# EAGLE design Led Controller (EAGLE 9.3.2)
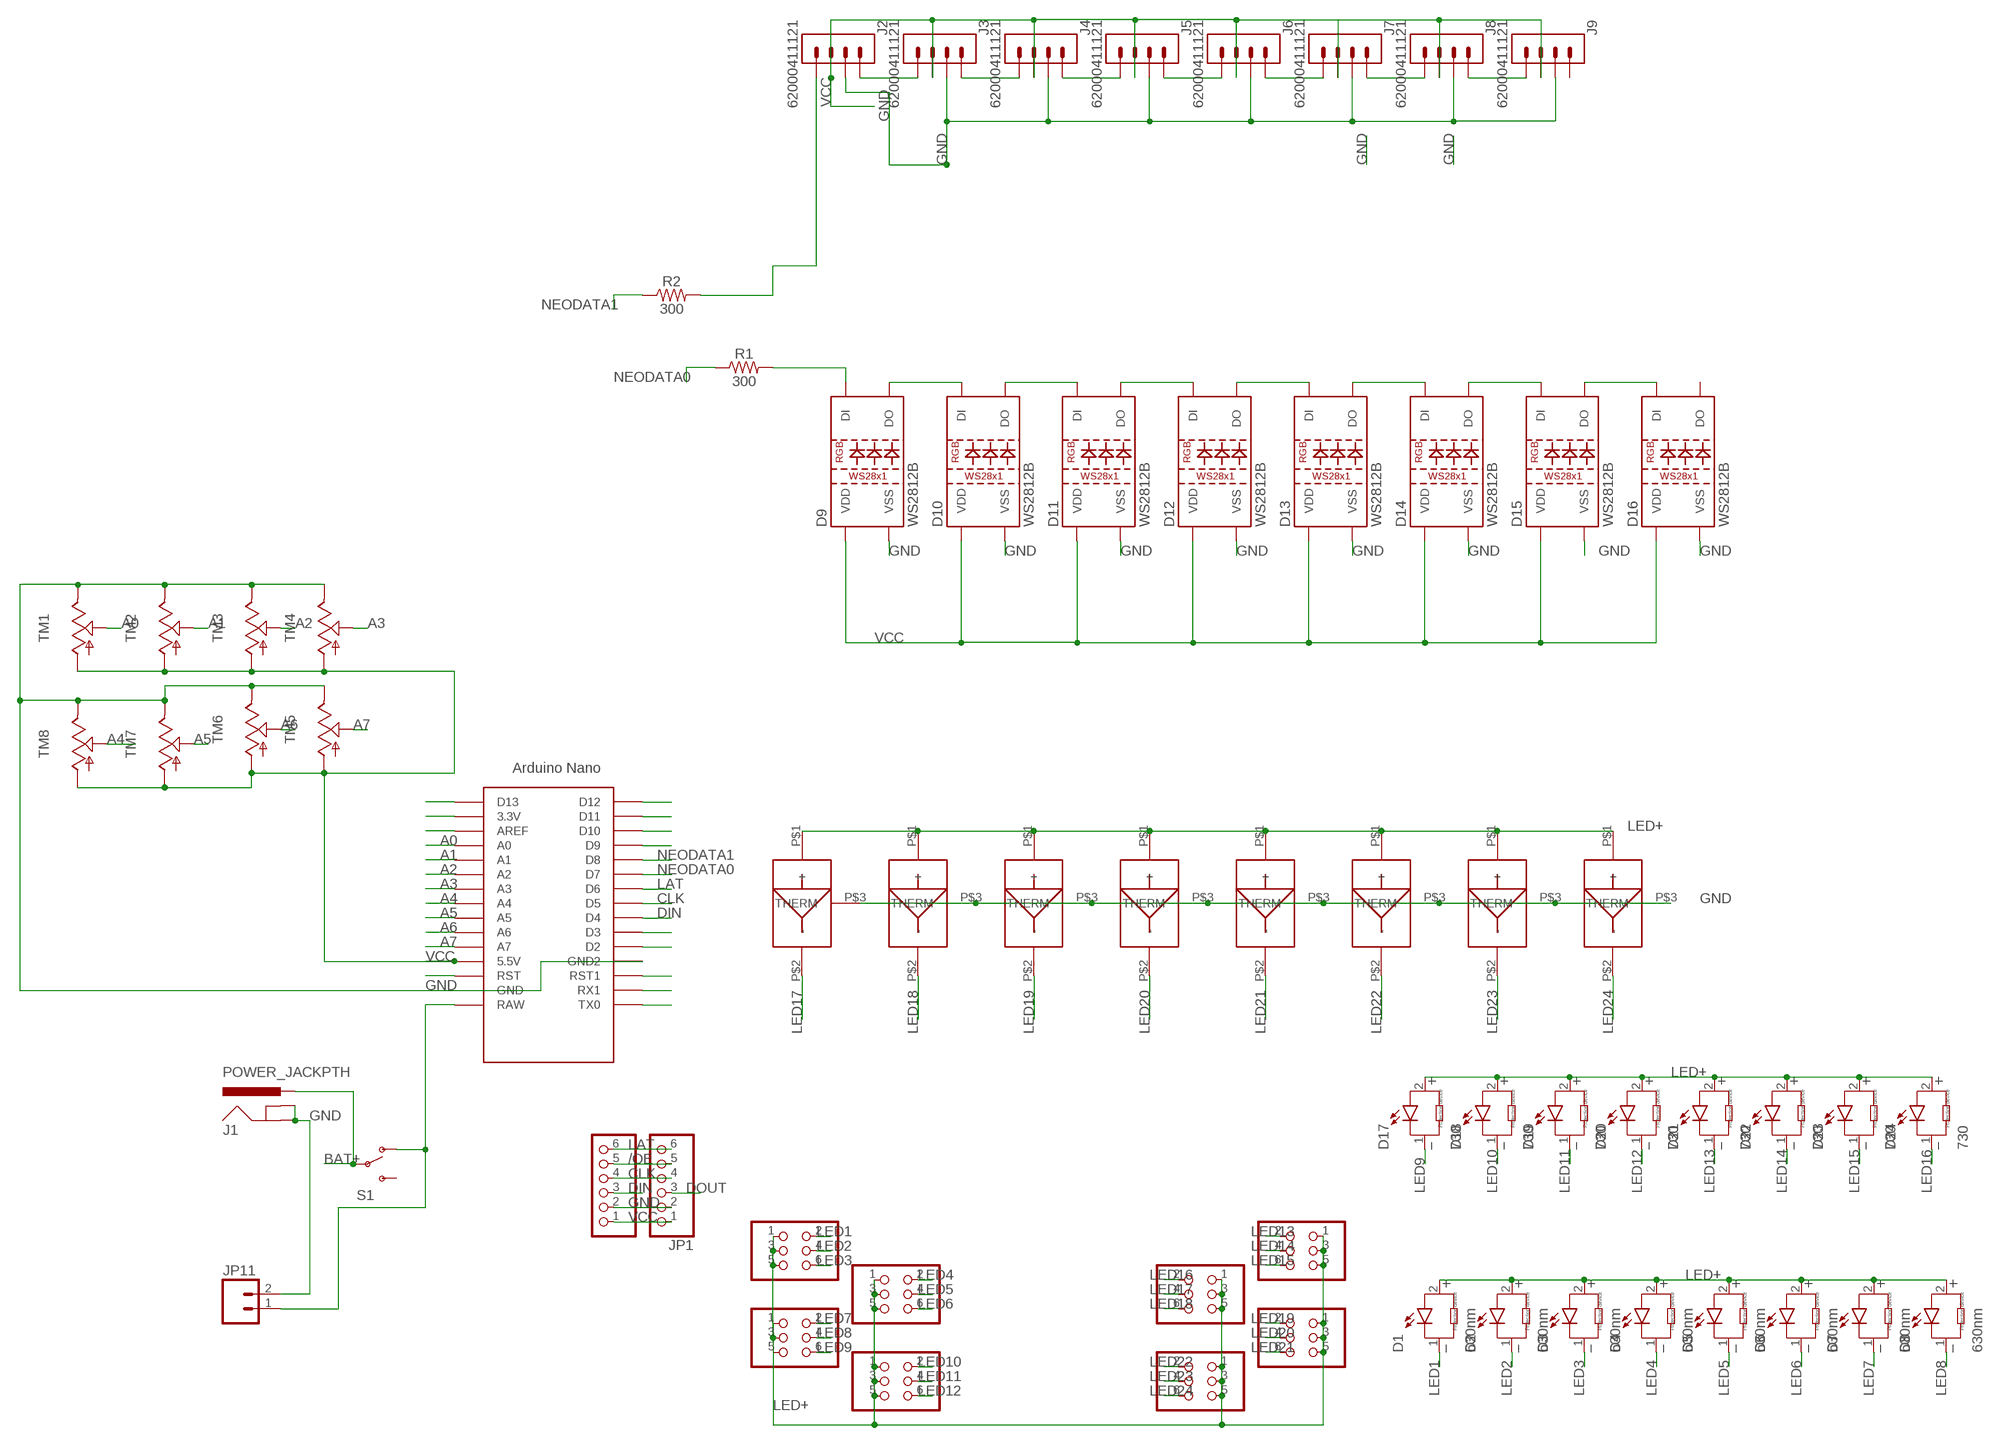
[diagram p0: schematic, sheet 1]

## Parts
D1  630nm  WL-SWTC_3535_158353027_2700K  [WL-SWTC_3535]
D2  630nm  WL-SWTC_3535_158353027_2700K  [WL-SWTC_3535]
D3  630nm  WL-SWTC_3535_158353027_2700K  [WL-SWTC_3535]
D4  630nm  WL-SWTC_3535_158353027_2700K  [WL-SWTC_3535]
D5  630nm  WL-SWTC_3535_158353027_2700K  [WL-SWTC_3535]
D6  630nm  WL-SWTC_3535_158353027_2700K  [WL-SWTC_3535]
D7  630nm  WL-SWTC_3535_158353027_2700K  [WL-SWTC_3535]
D8  630nm  WL-SWTC_3535_158353027_2700K  [WL-SWTC_3535]
D9  WS2812B  [WS2812B]
D10  WS2812B  [WS2812B]
D11  WS2812B  [WS2812B]
D12  WS2812B  [WS2812B]
D13  WS2812B  [WS2812B]
D14  WS2812B  [WS2812B]
D15  WS2812B  [WS2812B]
D16  WS2812B  [WS2812B]
D17  730  WL-SWTC_3535_158353027_2700K  [WL-SWTC_3535]
D18  730  WL-SWTC_3535_158353027_2700K  [WL-SWTC_3535]
D19  730  WL-SWTC_3535_158353027_2700K  [WL-SWTC_3535]
D20  730  WL-SWTC_3535_158353027_2700K  [WL-SWTC_3535]
D21  730  WL-SWTC_3535_158353027_2700K  [WL-SWTC_3535]
D22  730  WL-SWTC_3535_158353027_2700K  [WL-SWTC_3535]
D23  730  WL-SWTC_3535_158353027_2700K  [WL-SWTC_3535]
D24  730  WL-SWTC_3535_158353027_2700K  [WL-SWTC_3535]
J1  POWER_JACKPTH  [POWER_JACK_PTH]
J2  62000411121  [62000411121]
J3  62000411121  [62000411121]
J4  62000411121  [62000411121]
J5  62000411121  [62000411121]
J6  62000411121  [62000411121]
J7  62000411121  [62000411121]
J8  62000411121  [62000411121]
J9  62000411121  [62000411121]
JP1  INPUT  PINHD-1X6CB  [1X06-CLEANBIG]
JP2  HEADER-2X3  [2X03_ROUND_70MIL]
JP3  HEADER-2X3  [2X03_ROUND_70MIL]
JP4  HEADER-2X3  [2X03_ROUND_70MIL]
JP5  HEADER-2X3  [2X03_ROUND_70MIL]
JP6  HEADER-2X3  [2X03_ROUND_70MIL]
JP7  HEADER-2X3  [2X03_ROUND_70MIL]
JP8  HEADER-2X3  [2X03_ROUND_70MIL]
JP9  HEADER-2X3  [2X03_ROUND_70MIL]
JP10  OUTPUT  PINHD-1X6CB  [1X06-CLEANBIG]
JP11  M02POLAR  [MOLEX-1X2]
R1  300  300OHM-0603-1/10W-1%  [0603]
R2  300  300OHM-0603-1/10W-1%  [0603]
S1  SWITCH-SPSTPTH  [SWITCH-SPDT]
TM1  TRIM  [6MM]
TM2  TRIM  [6MM]
TM3  TRIM  [6MM]
TM4  TRIM  [6MM]
TM5  TRIM  [6MM]
TM6  TRIM  [6MM]
TM7  TRIM  [6MM]
TM8  TRIM  [6MM]
U$1  NANO  [NANO]
U$2  2X2MMLED  [2X2LED]
U$3  2X2MMLED  [2X2LED]
U$4  2X2MMLED  [2X2LED]
U$5  2X2MMLED  [2X2LED]
U$6  2X2MMLED  [2X2LED]
U$7  2X2MMLED  [2X2LED]
U$8  2X2MMLED  [2X2LED]
U$9  2X2MMLED  [2X2LED]

## Nets
/OE: JP1.5 JP10.5
A0: TM1.S U$1.A0
A1: TM2.S U$1.A1
A2: TM3.S U$1.A2
A3: TM4.S U$1.A3
A4: TM8.S U$1.A4
A5: TM7.S U$1.A5
A6: TM6.S U$1.A6
A7: TM5.S U$1.A7
BAT+: J1.PWR S1.2(P)
CLK: JP1.4 JP10.4 U$1.D5
DATAIN: J2.4 R2.2
DIN: JP10.3 U$1.D4
DOUT: JP1.3
GND: D9.3(VSS) D10.3(VSS) D11.3(VSS) D12.3(VSS) D13.3(VSS) D14.3(VSS) D15.3(VSS) D16.3(VSS) J1.GND J1.GNDBREAK J2.2 J3.2 J4.2 J5.2 J6.2 J7.2 J8.2 J9.2 JP1.2 JP10.2 JP11.2 TM1.E TM2.E TM3.E TM4.E TM5.E TM6.E TM7.E TM8.E U$1.GND U$1.GND1(GND2) U$2.P$3(THERM) U$3.P$3(THERM) U$4.P$3(THERM) U$5.P$3(THERM) U$6.P$3(THERM) U$7.P$3(THERM) U$8.P$3(THERM) U$9.P$3(THERM)
LAT: JP1.6 JP10.6 U$1.D6
LED1: D1.1 JP2.2
LED2: D2.1 JP2.4
LED3: D3.1 JP2.6
LED4: D4.1 JP3.2
LED5: D5.1 JP3.4
LED6: D6.1 JP3.6
LED7: D7.1 JP4.2
LED8: D8.1 JP4.4
LED9: D17.1 JP4.6
LED10: D18.1 JP5.2
LED11: D19.1 JP5.4
LED12: D20.1 JP5.6
LED13: D21.1 JP6.2
LED14: D22.1 JP6.4
LED15: D23.1 JP6.6
LED16: D24.1 JP7.2
LED17: JP7.4 U$2.P$2(-)
LED18: JP7.6 U$3.P$2(-)
LED19: JP8.2 U$4.P$2(-)
LED20: JP8.4 U$5.P$2(-)
LED21: JP8.6 U$6.P$2(-)
LED22: JP9.2 U$7.P$2(-)
LED23: JP9.4 U$8.P$2(-)
LED24: JP9.6 U$9.P$2(-)
LED+: D1.2 D2.2 D3.2 D4.2 D5.2 D6.2 D7.2 D8.2 D17.2 D18.2 D19.2 D20.2 D21.2 D22.2 D23.2 D24.2 JP2.1 JP2.3 JP2.5 JP3.1 JP3.3 JP3.5 JP4.1 JP4.3 JP4.5 JP5.1 JP5.3 JP5.5 JP6.1 JP6.3 JP6.5 JP7.1 JP7.3 JP7.5 JP8.1 JP8.3 JP8.5 JP9.1 JP9.3 JP9.5 U$2.P$1(+) U$3.P$1(+) U$4.P$1(+) U$5.P$1(+) U$6.P$1(+) U$7.P$1(+) U$8.P$1(+) U$9.P$1(+)
N$1: JP11.1 S1.1(O) U$1.RAW
N$2: U$1.RST
N$3: D9.2(DO) D10.4(DI)
N$4: D10.2(DO) D11.4(DI)
N$5: D11.2(DO) D12.4(DI)
N$6: D12.2(DO) D13.4(DI)
N$7: D13.2(DO) D14.4(DI)
N$8: D14.2(DO) D15.4(DI)
N$9: D15.2(DO) D16.4(DI)
N$11: U$1.AREF
N$12: U$1.3.3V
N$13: U$1.D13
N$14: U$1.D12
N$15: U$1.D11
N$16: U$1.D10
N$17: U$1.D9
N$23: U$1.D3
N$24: U$1.D2
N$25: U$1.RST1
N$26: U$1.RX1
N$27: U$1.TX0
N$30: J2.1 J3.4
N$31: J3.1 J4.4
N$32: J4.1 J5.4
N$33: D9.4(DI) R1.2
N$34: J5.1 J6.4
N$35: J6.1 J7.4
N$36: J7.1 J8.4
N$37: J8.1 J9.4
NEODATA0: R1.1 U$1.D7
NEODATA1: R2.1 U$1.D8
VCC: D9.1(VDD) D10.1(VDD) D11.1(VDD) D12.1(VDD) D13.1(VDD) D14.1(VDD) D15.1(VDD) D16.1(VDD) J2.3 J3.3 J4.3 J5.3 J6.3 J7.3 J8.3 J9.3 JP1.1 JP10.1 TM1.A TM2.A TM3.A TM4.A TM5.A TM6.A TM7.A TM8.A U$1.5V(5.5V)
Unconnected: D16.2(DO) J9.1 S1.3(S) U$1.ICSP1 U$1.ICSP2 U$1.ICSP3 U$1.ICSP4 U$1.ICSP5 U$1.ICSP6

## Library data of the parts
D1-D8 D17-D24 = Wurth_Elektronik_Optoelectronics_rev17b:WL-SWTC_3535: WL-SWTC SMD White Top view Ceramic LED Size 3535, waterclear dome lens Characteristics Fast switching No IR radiation High brightness Minimal side emission Waterclear silicone lens Top view Flexible coupling with secondary optic Various color temperatures Compact footprint Thermal resistance junction to solder point: 8 °K/W LED junction temperature: 150 °C Moisture Sensitivity Level: 2 Applications Indoor lighting: Spot light, Down light Outdoor lighting: Street light, Security light, Tunnel light, Parking lots light Industrial lighting: High-bay light, Low-bay light Consumer lighting: Torch light Agricultural equipment lighting Signal and symbol luminaries <http://katalog.we-online.de/media/images/eipal/WL-SWTC_pf2.jpg> Details see: http://katalog.we-online.de/en/led/WL-SWTC/158353060?m Created 2015-01-06, 2015 (C) Wurth Elektronik; OC_NEWARK: unknown
D9-D16 = SparkFun-LED:WS2812B: WS2812B SMD addressable RGB LED 5x5mm SMD LED with built-in controller IC. Color: Red/Green/Blue mC Rating: RGB: 390, 660, 180 mcd Forward Voltage: RGB: 2.0, 3.0, 3.0 V Packages:WS2812B SparkFun Products: Blynk Board - ESP8266 <https://www.sparkfun.com/products/13794>; MPN: WS2812B; OC_NEWARK: 43Y4720; PROD_ID: DIO-12503
J1 = SparkFun:POWER_JACK: Power Jack This is the standard 5.5mm barrel jack for power. The PTH is the most common, proven, reliable, footprint. All others are experimental. The Slot footprint only works if the mill layer is transmitted to the PCB fab house so be warned. Spark Fun Electronics SKU : PRT-00119. Mating wall wart : TOL-00298 (and others); MPN: RAPC712BK; OC_NEWARK: 03M4244
J2-J9 = Headers:62000411121: THT Vertical Pin Header WR-PHD, Pitch 2.00 mm, Single Row, 4 pins Manufacturer's datasheet <https://datasheet.octopart.com/62000411121-W%C3%BCrth-Elektronik-datasheet-117282003.pdf>; CREATED_BY: PCBLayout.com; MANUFACTURER: Würth Elektronik; OC_NEWARK: unknown
JP1 JP10 = adafruit:PINHD-1X6: PIN HEADER; MPN: 1016; OC_NEWARK: 31Y5676
JP2-JP9 = microbuilder:HEADER-2X3: PIN HEADER; OC_NEWARK: unknown
JP11 = SparkFun:M02: Header 2 Standard 2-pin 0.1" header. Use with straight break away headers (SKU : PRT-00116), right angle break away headers (PRT-00553), swiss pins (PRT-00743), machine pins (PRT-00117), and female headers (PRT-00115). Molex polarized connector foot print use with SKU : PRT-08233 with associated crimp pins and housings.; MPN: 171856-0002; OC_NEWARK: 06X9806
R1 R2 = SparkFun-Resistors:300OHM: 300Ω resistor A resistor is a passive two-terminal electrical component that implements electrical resistance as a circuit element. Resistors act to reduce current flow, and, at the same time, act to lower voltage levels within circuits. - Wikipedia; MPN: MC0603SAF3000T5E; OC_NEWARK: 04P0374; PROD_ID: RES_10328
S1 = SparkFun:SWITCH-SPST: SPST Switch Simple slide switch. Spark Fun Electronics SKU : COM-00102; MPN: 1825232-1; OC_NEWARK: 97X7939
TM1-TM8 = adafruit:TRIM; MF: BOURNS, INC.; MPN: 3306F-1-103; OC_NEWARK: 04B2986
U$1 = Arduino-clone:NANO: Arduino Nano; OC_NEWARK: unknown
U$2-U$9 = 2x2mmled:2X2MMLED; OC_NEWARK: unknown

## Net classes
0 everything: width 0.254 mm

## Board
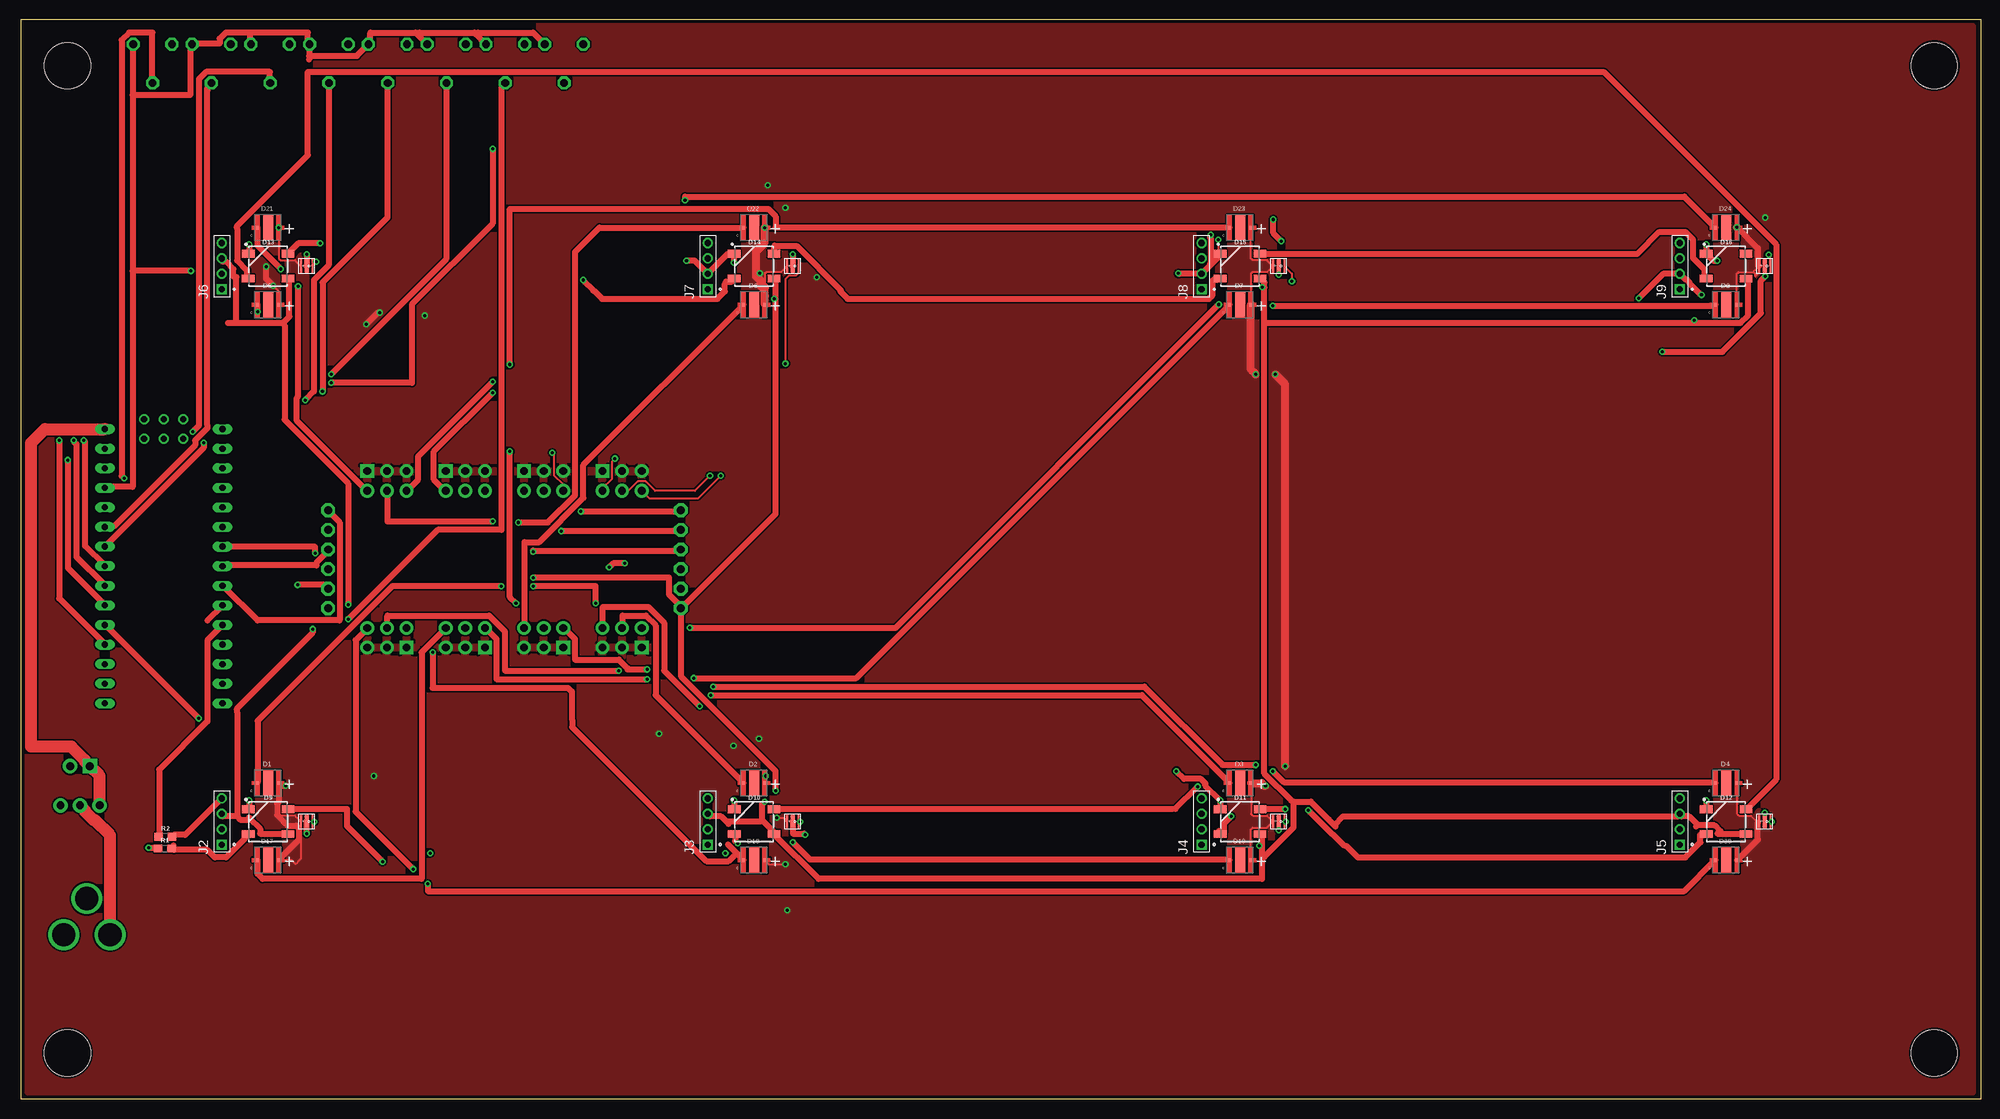
[diagram p1: board, top side]
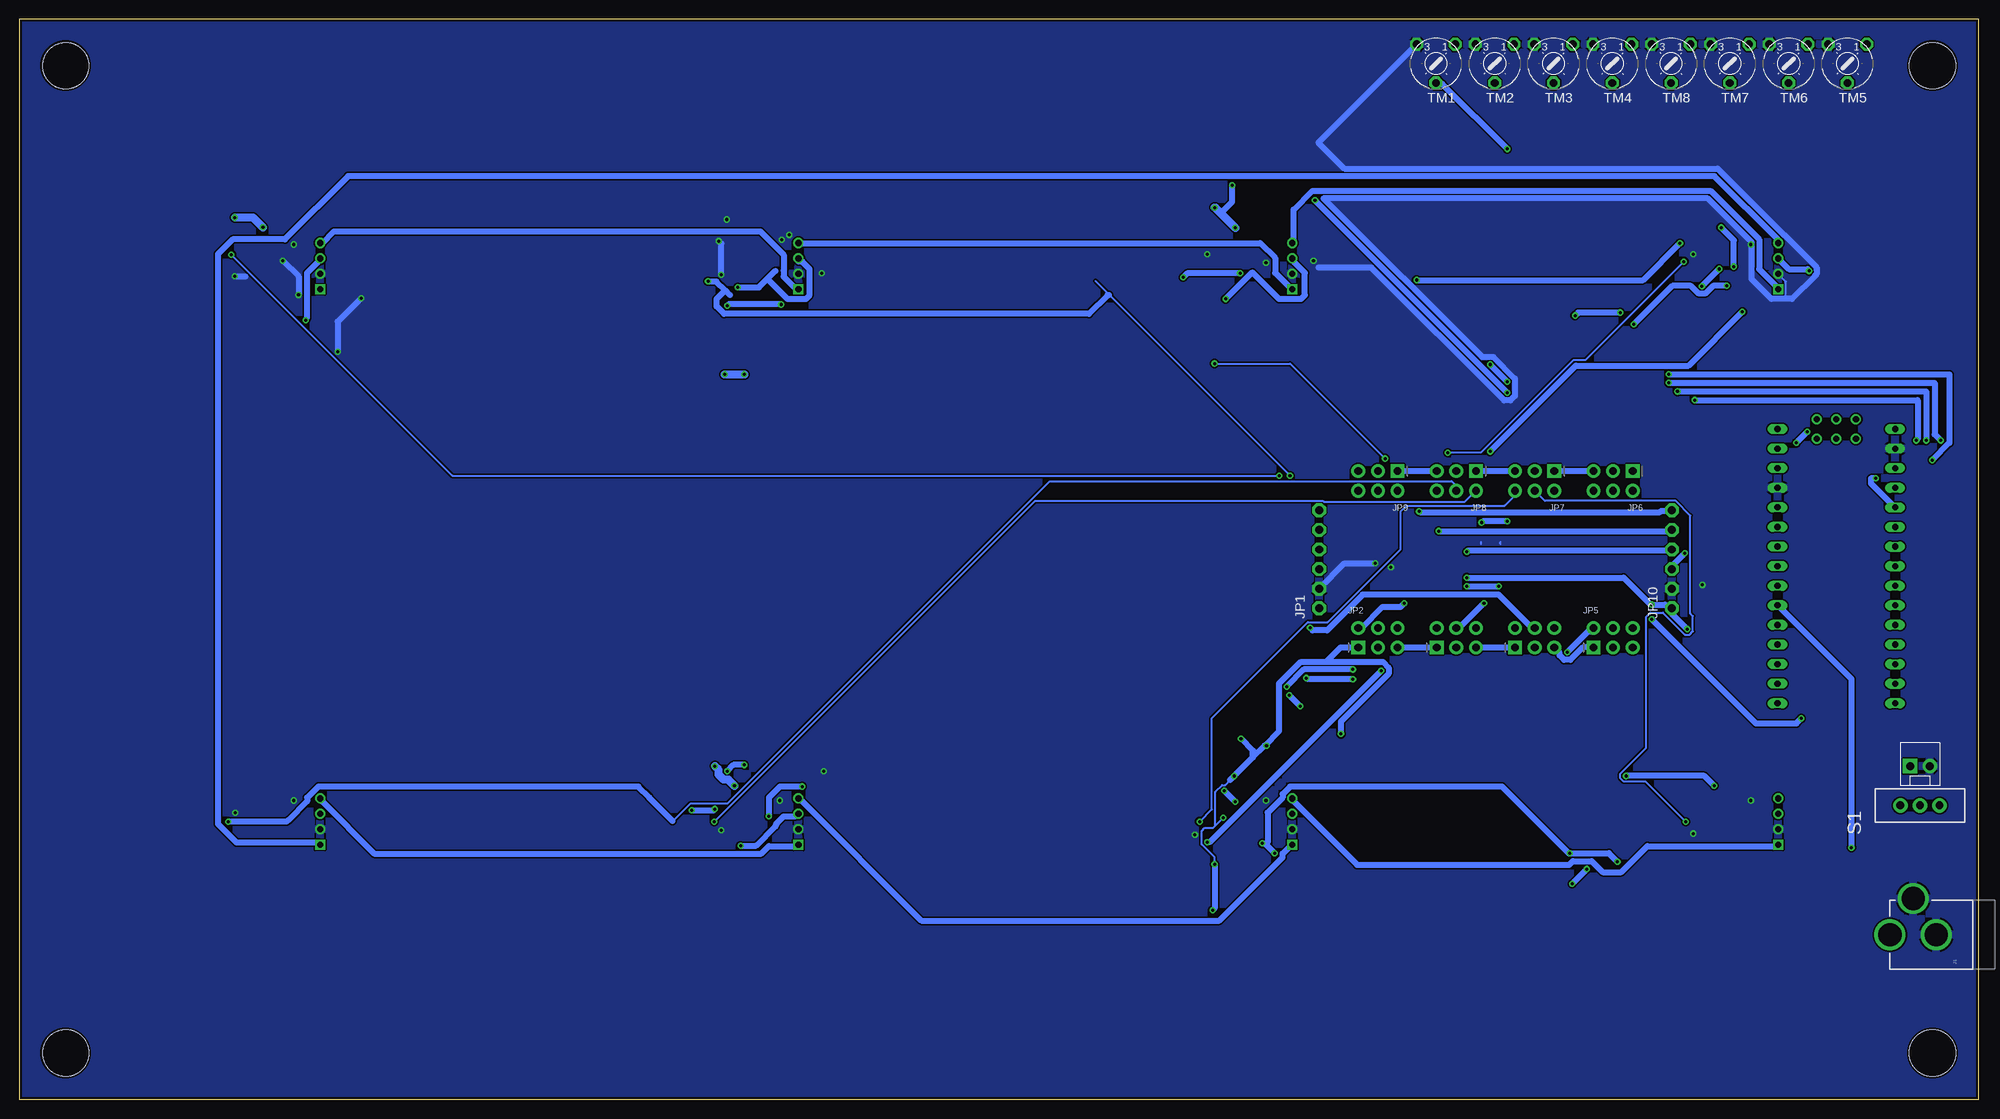
[diagram p2: board, bottom side, seen from below]

Size 254 x 140 mm. Coordinates in mm from the lower left corner, seen from the top.
Outline: 0,0 0,140 254,140 254,0 0,0
Copper layers (1*16): Top 0.035mm / dielectric 1.5mm / Bottom 0.035mm
Design rules "adafruit *": minimum track width 10mil, minimum drill 15.5mil, track to track 8mil, track to pad 8mil, pad to pad 8mil, via to via 8mil, smd to smd 8mil, copper to edge 10mil, drill to drill 8mil, minimum pad ring 10mil, minimum via ring 8mil, stop-mask expansion 4mil, vias tented up to drill 20mil, thermal gap 10mil
Holes 6 mm at 6,134 248,134 6,6 248,6

### Footprints (pad centres in the part's own frame; a part is rotated, then mirrored left to right if it is on the bottom)
WL-SWTC_3535 = smd 0.4 x 0.5: 1 -1.4,0; 2 1.4,0 | smd 1.3 x 3.3: 3 0,0
WS2812B = smd 1.651 x 1: 1 2.577,-1.6; 2 2.577,1.6; 3 -2.577,1.6; 4 -2.577,-1.6
POWER_JACK_PTH = drill 2.997: GND 0,7.7; GNDBREAK 4.7,10.7; PWR 0,13.7
62000411121 = drill 0.8 square: 1 -3,0 | drill 0.8: 2 -1,0; 3 1,0; 4 3,0
1X06-CLEANBIG = drill 1.016 pad 1.778 octagon: 1 -6.35,0; 2 -3.81,0; 3 -1.27,0; 4 1.27,0; 5 3.81,0; 6 6.35,0
2X03_ROUND_70MIL = drill 1 pad 1.778 square: 1 -2.54,-1.27 | drill 1 pad 1.778: 2 -2.54,1.27; 3 0,-1.27; 4 0,1.27; 5 2.54,-1.27; 6 2.54,1.27
MOLEX-1X2 = drill 1.016 pad 1.88 square: 1 0,0 | drill 1.016 pad 1.88: 2 2.54,0
0603 = smd 1.1 x 1: 1 -0.85,0; 2 0.85,0
SWITCH-SPDT = drill 1.016 pad 1.88: 1 0,2.54; 2 0,0; 3 0,-2.54
6MM = drill 1 pad 1.676 octagon: A -2.5,-2.5; E 2.5,-2.5; S 0,2.5
NANO = drill 0.8 long: 3.3V -10.16,24.13; 5V -10.16,-1.27; A0 -10.16,19.05; A1 -10.16,16.51; A2 -10.16,13.97; A3 -10.16,11.43; A4 -10.16,8.89; A5 -10.16,6.35; A6 -10.16,3.81; A7 -10.16,1.27; AREF -10.16,21.59; D2 5.08,1.27; D3 5.08,3.81; D4 5.08,6.35; D5 5.08,8.89; D6 5.08,11.43; D7 5.08,13.97; D8 5.08,16.51; D9 5.08,19.05; D10 5.08,21.59; D11 5.08,24.13; D12 5.08,26.67; D13 -10.16,26.67; GND -10.16,-6.35; GND1 5.08,-1.27; RAW -10.16,-8.89; RST -10.16,-3.81; RST1 5.08,-3.81; RX1 5.08,-6.35; TX0 5.08,-8.89 | drill 0.8: ICSP1 -5.08,-10.16; ICSP2 -5.08,-7.62; ICSP3 -2.54,-10.16; ICSP4 -2.54,-7.62; ICSP5 0,-10.16; ICSP6 0,-7.62
2X2LED = smd 0.3 x 1.8: P$1 -0.75,0; P$2 0.75,0 | smd 0.6 x 1.8: P$3 0,0

### Placement (x,y rotation side)
D1  32,41 0 top
D2  95,41 0 top
D3  158,41 0 top
D4  221,41 0 top
D5  32,103 0 top
D6  95,103 0 top
D7  158,103 0 top
D8  221,103 0 top
D9  32,36 0 top
D10  95,36 0 top
D11  158,36 0 top
D12  221,36 0 top
D13  32,108 0 top
D14  95,108 0 top
D15  158,108 0 top
D16  221,108 0 top
D17  32,31 0 top
D18  95,31 0 top
D19  158,31 0 top
D20  221,31 0 top
D21  32,113 0 top
D22  95,113 0 top
D23  158,113 0 top
D24  221,113 0 top
J1  -2.19,21.33 90 bottom
J2  26,36 90 top
J3  89,36 90 top
J4  153,36 90 top
J5  215,36 90 top
J6  26,108 90 top
J7  89,108 90 top
J8  153,108 90 top
J9  215,108 90 top
JP1  85.5,70 90 bottom
JP2  77.88,59.84 0 bottom
JP3  67.72,59.84 0 bottom
JP4  57.56,59.84 0 bottom
JP5  47.4,59.84 0 bottom
JP6  47.4,80.16 180 bottom
JP7  57.56,80.16 180 bottom
JP8  67.72,80.16 180 bottom
JP9  77.88,80.16 180 bottom
JP10  39.78,70 90 bottom
JP11  8.89,43.18 0 bottom
R1  18.6,32.51 0 top
R2  18.67,34.04 0 top
S1  7.62,38.1 90 bottom
TM1  70.36,134.26 180 bottom
TM2  62.74,134.26 180 bottom
TM3  55.12,134.26 180 bottom
TM4  47.5,134.26 180 bottom
TM5  17.02,134.26 180 bottom
TM6  24.64,134.26 180 bottom
TM7  32.26,134.26 180 bottom
TM8  39.88,134.26 180 bottom
U$1  21,78 180 bottom
U$2  37,36 0 top
U$3  100,36 0 top
U$4  163,36 0 top
U$5  226,36 0 top
U$6  37,108 0 top
U$7  100,108 0 top
U$8  163,108 0 top
U$9  226,108 0 top

### Tracks (layer width: path | path; a pad name or v marks a point on that pad's centre or on a via)
/OE  (via drill 0.39)
  Top 0.762: v70.01,73.66 85.41,73.66 JP1.5
  Bottom 0.762: v70.01,73.66 39.85,73.66 JP10.5
A0  (via drill 0.39)
  Top 0.762: v4.92,85.41 4.92,64.93 10.79,59.05 U$1.A0 | v40.16,92.87 50.64,92.87 50.64,103.03 61.12,113.51 v61.12,123.19
  Bottom 0.762: v4.92,85.41 5.71,86.2 5.71,92.87 v40.16,92.87 | v61.12,123.19 69.53,131.6 70.33,131.6 TM1.S
A1  (via drill 0.39)
  Top 0.762: v23.02,49.37 10.95,61.44 U$1.A1 | v42.39,62.23 53.98,73.82 62.23,73.82 62.23,131.13 62.71,131.6 TM2.S
  Bottom 0.762: v23.02,49.37 23.65,48.74 28.89,48.74 v42.39,62.23
A2  (via drill 0.39)
  Top 0.762: v6.03,82.87 6.03,68.9 10.79,64.14 U$1.A2 | v40.16,93.98 55.09,108.9 55.09,131.6 TM3.S
  Bottom 0.762: v6.03,82.87 3.81,85.09 3.81,93.98 v40.16,93.98
A3  (via drill 0.39)
  Top 0.762: v6.83,85.41 6.83,85.25 7.14,84.93 7.14,70.33 10.79,66.67 U$1.A3 | v39.05,91.76 39.05,105.89 47.47,114.3 47.47,131.6 TM4.S
  Bottom 0.762: v6.83,85.41 6.83,91.76 v39.05,91.76
A4  (via drill 0.39)
  Top 0.762: v8.1,85.41 8.26,85.25 8.26,71.75 10.79,69.22 U$1.A4 | v36.83,90.65 37.94,91.76 37.94,106.2 39.85,108.11 39.85,131.6 TM8.S
  Bottom 0.762: v8.1,85.41 7.94,85.57 7.94,90.65 v36.83,90.65
A5  (via drill 0.39)
  Top 0.762: v23.65,85.09 23.65,84.45 10.95,71.75 U$1.A5 | v22.23,86.52 23.02,87.31 23.02,132.24 23.97,133.19 32.23,133.19 32.23,131.76 TM7.S
  Bottom 0.762: v22.23,86.52 v23.65,85.09
A6
  Top 0.762: U$1.A6 10.95,74.3 12.06,74.3 22.54,84.77 22.54,85.41 24.13,87 24.12,87.38 24.12,130.75 24.13,131.13 24.61,131.6 TM6.S
A7  (via drill 0.39)
  Top 0.762: v13.34,80.49 13.02,80.8 13.02,137.32 13.97,138.27 16.99,138.27 16.99,131.76 TM5.S
  Bottom 0.762: v13.34,80.49 13.97,80.49 13.97,79.85 10.95,76.83 U$1.A7
BAT+
  Top 1.524: J1.PWR 11.51,34.21 9.53,36.2 9.37,36.2 8.26,37.31 8.26,37.47 S1.2
CLK  (via drill 0.39)
  Top 0.762: U$1.D5 26.19,69.22 38.26,69.22 38.26,69.53 39.69,70.96 39.69,71.12 JP10.4 | v66.36,70.96 66.36,71.12 85.41,71.12 JP1.4
  Bottom 0.762: v66.36,70.96 66.2,71.12 39.85,71.12 JP10.4
DATAIN
  Top 0.762: 19.62,34.12 R2.2 19.79,34.27 21.23,34.27 25.58,38.61 J2.4
DIN  (via drill 0.39)
  Top 0.762: v38.1,70.8 38.1,71.6 26.19,71.6 U$1.D4
  Bottom 0.762: v38.1,70.8 39.69,69.22 39.69,68.74 JP10.3
GND  (via drill 0.39)
  Top 0.254: U$4.P$3 v163,34.87 | U$5.P$3 v226,37.13 | U$9.P$3 226,106.74 v226.06,106.68 | U$8.P$3 v163,106.87 | 154.13,108.13 155,109 155,109.5 D15.3 | v155.16,111.44 155.16,109.95 155.42,109.7
  Top 0.762: v29.53,38.73 29.53,37.62 D9.3 | v92.39,38.73 92.39,37.62 D10.3 | v29.53,110.81 29.53,109.7 D13.3 | D11.3 155.42,37.62 v155.42,38.73 153.49,40.66 153.49,40.95 152.91,41.52 150.75,41.52 v149.73,42.55 | v92.39,108.43 92.39,109.54 D14.3 91.6,109.6 J7.2 87.29,108.71 v86.23,108.71 | D15.3 155.42,109.7 155.42,109.42 154.13,108.13 | v218.44,38.73 218.44,37.62 D12.3 | v218.44,110.81 218.44,109.7 D16.3 219.31,108.71 v219.84,108.71 | v36.99,34.45 36.99,35.88 U$2.P$3 | U$3.P$3 100.01,35.88 100.01,34.45 101.44,34.45 v101.6,34.29 | v36.99,109.54 36.99,108.11 U$6.P$3 | v100.01,109.54 100.01,108.11 U$7.P$3 | JP10.2 39.3,66.67 v35.81,66.67 | v78.23,69.47 76.71,69.47 v76.2,68.96 | v163.32,111.25 162.31,112.27 v162.31,114.05 | 154.13,108.13 J8.2 150.05,107 v149.99,107.06 | v154.18,112.05 154.13,112 154.13,111.62 154.24,111.51 154.24,108.49 154.13,108.38 154.13,108.13 | v217.81,104.27 217.73,104.27 216.24,105.76 216.24,105.9 215.9,106.24 215.76,106.24 J9.2 212.82,107 v209.68,103.85 | v226.06,106.68 225.5,106.12 225.5,101.9 220.5,96.9 v212.72,96.9
  Bottom 0.254: J6.2 25,106 25,104 27,104 29.5,106.5 29.5,110.5 v29.53,110.81 | 64.5,72 64.5,72.21 | 62,72 62,72.21
  Bottom 0.762: TM1.E 85.6,124.02 82.23,120.65 33.87,120.65 25.42,112.21 25.15,112 25.15,111.99 21.02,107.85 21.02,107.69 21,107.67 21.02,107.51 21.02,106.97 21.08,106.91 21.08,106.88 21.21,106.78 24.22,103.76 26.9,103.76 29.44,106.3 29.44,111.08 35.15,116.79 84.94,116.79 64.39,96.23 62.93,96.23 60.13,93.44 60.13,91.19 60.71,90.61 61.53,90.61 78.73,107.82 85.6,107.82 | JP1.2 82.22,69.47 v78.23,69.47 | v163,106.87 163,110.93 v163.32,111.25 | v226.06,106.68 224.69,106.68 | v219.84,108.71 217.81,106.68 v217.81,104.27 | v209.68,103.85 212.72,100.81 v212.72,96.9
  pour Bottom: 0,139.7 254,139.7 254,0 0,0
LAT  (via drill 0.39)
  Top 0.762: U$1.D6 26.19,66.52 30.64,62.07 41.27,62.07 41.27,74.77 39.85,76.2 JP10.6 | v72.55,76.2 85.41,76.2 JP1.6
  Bottom 0.762: v72.55,76.2 72.39,76.04 41.43,76.04 41.27,76.2 39.85,76.2 JP10.6
LED1  (via drill 0.39)
  Top 0.762: v62.23,66.52 48.1,66.52 30.64,49.05 30.64,41.12 D1.1 | v66.36,66.52 74.45,66.52 v74.45,64.29
  Bottom 0.762: v66.36,66.52 v62.23,66.52 | v74.45,64.29 74.93,63.82 77.31,63.82 80.01,61.12 80.33,61.12 JP2.2
LED2
  Top 0.762: D2.1 93.5,41.12 82.23,52.39 82.23,61.44 80.96,62.71 77.95,62.71 77.95,61.12 JP2.4
LED3  (via drill 0.39)
  Top 0.762: v89.38,52.39 145.26,52.39 156.53,41.12 D3.1 | v87.95,50.96 83.34,55.56 83.34,61.75 81.28,63.82 75.41,63.82 75.41,61.12 JP2.6
  Bottom 0.762: v87.95,50.96 v89.38,52.39
LED4  (via drill 0.39)
  Top 0.762: v162.24,42.55 163.67,41.12 219.55,41.12 D4.1 | v160.02,43.34 155.73,43.34 145.57,53.5 v89.69,53.5 | v81.12,55.72 78.58,55.72 78.58,55.88 77.47,56.99 71.75,56.99 71.75,59.69 70.33,61.12 JP3.2
  Bottom 0.762: v162.24,42.55 161.45,43.34 v160.02,43.34 | v89.69,53.5 87.47,55.72 v81.12,55.72
LED5  (via drill 0.39)
  Top 0.762: v30.64,102.08 30.64,102.87 D5.1 | v63.34,83.98 63.34,65.09 v64.14,64.29
  Bottom 0.762: v30.64,102.08 37.62,95.09 52.23,95.09 v63.34,83.98 | v64.14,64.29 67.31,61.12 67.63,61.12 JP3.4
LED6
  Top 0.762: D6.1 93.5,102.87 72.87,82.23 72.87,77.95 67.15,72.23 65.25,72.23 65.25,61.12 JP3.6
LED7  (via drill 0.39)
  Top 0.762: v87.15,54.61 108.27,54.61 156.53,102.87 D7.1 | v81.12,54.45 61.59,54.45 61.59,59.69 60.17,61.12 JP4.2
  Bottom 0.762: v87.15,54.61 87,54.45 v81.12,54.45
LED8  (via drill 0.39)
  Top 0.762: v162.24,102.87 219.55,102.87 D8.1 | v155.26,103.03 113.35,61.12 v86.68,61.12
  Bottom 0.762: v162.24,102.87 162.08,103.03 v155.26,103.03 | v86.68,61.12 86.36,60.8 84.45,60.8 79.85,65.41 62.23,65.41 57.94,61.12 57.63,61.12 JP4.4
LED9
  Top 0.762: D17.1 30.64,30.96 30.64,29.21 31.27,28.57 51.91,28.57 51.91,57.94 54.93,60.96 JP4.6
LED10  (via drill 0.39)
  Top 0.762: v53.34,57.94 53.34,53.34 70.87,53.34 71.38,52.83 71.38,49.25 71.42,49.23 71.42,48.26 88.8,30.89 91.69,30.89 92.72,31.91 | D18.1 93.5,31.11 93.25,31.38 92.72,31.91 | 91.62,33 92.72,31.91
  Bottom 0.762: v53.34,57.94 50.64,60.64 50.48,60.64 50.16,60.96 50.01,60.96 JP5.2
LED11  (via drill 0.39)
  Top 0.762: v100.01,33.34 102.23,31.11 156.53,31.11 D19.1 | v77.47,55.56 62.71,55.56 62.71,60.64 60.64,62.71 47.47,62.71 47.47,61.12 JP5.4
  Bottom 0.762: v100.01,33.34 99.69,33.34 v77.47,55.56
LED12  (via drill 0.39)
  Top 0.762: v52.7,27.94 52.7,26.99 215.58,26.99 219.55,30.96 D20.1 | v50.8,29.84 43.34,37.31 43.34,59.53 44.77,60.96 JP5.6
  Bottom 0.762: v50.8,29.84 v52.7,27.94
LED13  (via drill 0.39)
  Top 0.762: v33.66,107.63 30.64,110.65 30.64,112.87 D21.1 | v35.88,105.41 35.88,91.12 35.72,90.96 35.72,87.95 44.77,78.9 JP6.2
  Bottom 0.762: v35.88,105.41 v33.66,107.63
LED14  (via drill 0.39)
  Top 0.762: v64.45,74.77 68.26,74.77 71.81,78.32 71.81,109.86 74.95,113 D22.1 | v61.12,74.93 47.47,74.93 47.47,78.74 JP6.4
  Bottom 0.762: v64.45,74.77 64.29,74.93 v61.12,74.93
LED15  (via drill 0.39)
  Top 0.762: v63.34,95.25 63.34,115.41 96.84,115.41 97.79,114.46 97.79,113.03 156.53,113.03 D23.1 | v61.12,93.03 51.44,83.34 51.44,80.33 50.01,78.9 JP6.6
  Bottom 0.762: v61.12,93.03 v63.34,95.25
LED16  (via drill 0.39)
  Top 0.762: v86.04,116.52 86.04,117 215.58,117 219.55,113.03 D24.1 | v61.12,91.6 53.5,83.98 53.5,80.33 54.93,78.9 JP7.2
  Bottom 0.762: v61.12,91.6 v86.04,116.52
LED17  (via drill 0.39)
  Top 0.254: U$2.P$2 37.77,35.98 v37.99,35.98
  Bottom 0.254: v37.99,35.98 43.19,41.18 46.02,41.18 46.45,41.61 46.45,42.21 43.12,45.55 43.12,62.53 42.55,63.1 40.96,63.1 38.09,60.23 37.48,60.23 37.05,60.66 37.05,62.64 37.37,62.96 37.37,75.66 39.28,77.57 56.24,77.57 JP7.4
LED18  (via drill 0.39)
  Top 0.254: U$3.P$2 v101,36
  Bottom 0.254: v101,36 99.42,37.58 99.42,49.41 86.98,61.85 84.41,61.85 74.93,71.33 74.93,76.2 74.17,76.96 61.47,76.96 60.1,78.33 JP7.6
LED19  (via drill 0.39)
  Top 0.254: U$4.P$2 v163.9,36
  Bottom 0.254: v163.9,36 122.33,77.57 85,77.57 84.9,77.47 66.6,77.47 JP8.2
LED20  (via drill 0.39)
  Top 0.254: U$5.P$2 v226.9,36
  Bottom 0.254: 169.34,36 169.3,36.05 166.99,38.35 162.2,38.35 120.44,80.11 68.35,80.11 68.33,80.14 67.72,79.53 JP8.4
  Bottom 0.762: v226.9,36 219.38,36 219.1,36.2 216.69,38.61 216.69,39.09 215.24,40.54 173.74,40.54 172.29,39.09 172.31,39.06 | 169.3,36.05 172.31,39.06 | 172.31,39.06 172.38,39.12
LED21  (via drill 0.39)
  Top 0.254: U$6.P$2 37.75,108.11 v38.23,108.58 | v68.83,83.82 69.04,83.61 69.04,80.92 70.26,79.71 JP8.6
  Bottom 0.254: v38.23,108.58 51.01,95.8 52.55,95.8 64.53,83.82 v68.83,83.82
LED22  (via drill 0.39)
  Top 0.254: v99.06,95.38 99.06,106.31 99.52,106.77 100.38,106.77 100.72,107.11 100.72,107.97 U$7.P$2 | v76.96,83.06 76.56,82.66 76.56,80.4 75.34,79.19 JP9.2
  Bottom 0.254: v99.06,95.38 89.28,95.38 v76.96,83.06
LED23  (via drill 0.39)
  Top 0.254: U$8.P$2 164.72,107.03 v164.72,106.05 | v89.28,80.84 87.31,78.87 82.17,78.87 80.93,80.11 79.92,80.11 78.67,78.87 77.91,78.87 JP9.4
  Bottom 0.254: 114.49,106.05 112.72,104.28 v89.28,80.84
  Bottom 0.762: 161.88,104.25 162.49,104.87 | 162.49,104.87 163.62,106 164.62,106 v164.72,106.05 | 112.72,104.28 112.75,104.25 112.93,104.24 115.34,101.83 162.64,101.83 163.6,102.79 163.6,103.76 162.49,104.87
LED24  (via drill 0.39)
  Top 0.254: U$9.P$2 226.75,109.25 v226.5,109.5 | v90.68,80.84 87.69,77.85 81.46,77.85 JP9.6
  Bottom 0.254: v226.5,109.5 197.85,80.84 v90.68,80.84
LED+  (via drill 0.39)
  Top 0.254: D17.2 35.04,31 35.56,30.48 36.25,31.17 U$2.P$1 35.48,36.77 33.62,36.77 33.4,36.98 D1.2 | D18.2 96.92,30.48 v99.06,30.48 | v97.93,36.5 98.75,36.5 U$3.P$1 | v96.52,41.91 96.4,41.79 D2.2 | D19.2 159.4,35.02 159.62,35.23 161.48,35.23 U$4.P$1 161.48,36.77 159.62,36.77 159.42,36.96 159.42,40.98 D3.2 | D4.2 222.4,36.98 222.62,36.77 224.22,36.77 225.11,35.88 225.23,36 U$5.P$1 | 224.48,107.23 222.62,107.23 222.4,107.02 D8.2 | 224.48,107.23 U$9.P$1 225.25,107.14 224.79,106.68 224.73,106.74 224.73,107.04 224.54,107.23 224.48,107.23 | D23.2 159.4,108.98 159.62,108.77 161.48,108.77 U$8.P$1 161.48,107.23 159.62,107.23 159.4,107.02 D7.2 | U$7.P$1 98.48,107.23 96.61,107.23 96.4,107.02 96.4,104.14 | U$6.P$1 35.48,108.77 33.62,108.77 33.4,108.98 D21.2 | D5.2 33.4,104.73 v32.68,105.45
  Top 0.762: 225.11,35.88 225.11,33.66 222.41,30.96 D20.2 | v222.41,113.03 225.11,110.33 225.11,108.11 U$9.P$1 | v31.75,107.95 31.75,106.38 v32.68,105.45 | D17.2 33.4,31.07 35.99,33.66 35.99,35.14 35.64,35.48 34.54,35.48 33.17,36.86 33.17,38.34 33.4,38.58 D1.2 33.76,40.64 v34.29,40.64 | v44.7,100.46 46.23,101.98 v46.48,101.98 | D6.2 96.23,103.17 96.23,104.89 95.76,105.37 v95.76,107.06
  Top 1.016: D3.2 160.81,41 161.23,40.58 | v163.83,43.18 163.83,92.71 v162.56,93.98 | v160.02,93.98 159.4,94.6 D7.2 | D24.2 v222.4,113.02 v222.41,113.03 | D6.2 96.4,104.14 96.4,105.25 96.04,105.61 96.04,105.89 95.25,106.68 95.25,109.94 96.36,111.06 v96.36,112.96 D22.2
  Bottom 0.254: v99.06,30.48 99.06,31.35 100.74,33.03 100.74,34.75 100.31,35.18 99.25,35.18 98.96,35.46 | 98.96,35.46 v97.93,36.5 | v96.52,41.91 97.03,41.4 97.69,40.73 98.09,40.73 98.96,39.87 98.96,35.46
  Bottom 0.762: v31.75,107.95 31.75,111.35 D21.2 | v34.29,40.64 35.56,41.91 v45.72,41.91 | JP6.5 JP7.1 | JP7.5 JP8.1 | JP8.5 JP9.1 | JP2.5 JP3.1 | JP3.5 JP4.1 | JP4.5 54.32,57.87 54.32,57.54 53.75,56.96 52.93,56.96 51.32,58.57 JP5.1 | v44.7,100.46 39.71,105.45 37.31,105.45 36.28,104.43 35.47,104.43 34.45,105.45 v32.68,105.45 | v46.48,101.98 51.94,101.98 v52.32,101.6 | v99.06,30.48 99.06,24.77 v99.31,24.51 | 97.03,41.4 94.11,44.32 | 94.11,44.32 92.58,45.85 | 92.58,45.85 v92.33,45.85 | 94.11,44.32 94.11,45.21 v95.63,46.74 | v82.68,47.37 82.68,48.96 76.49,55.16 76.49,55.97 77.22,56.71 84.58,56.71 | 84.58,56.71 87.88,56.71 90.68,53.91 90.68,47.75 92.58,45.85 | 84.58,56.71 82.72,58.57 JP2.1 | 98.25,114.85 96.77,116.33 v96.77,118.49 | v95.76,107.06 102.62,107.06 v103.12,106.55
  Bottom 1.016: v161.29,40.64 162.08,41.43 162.7,41.43 163.35,42.09 163.35,42.7 v163.83,43.18 | v162.56,93.98 v160.02,93.98 | v222.41,113.03 223.68,114.3 v226.06,114.3 | v96.36,112.96 98.25,114.85 98.97,115.57 v99.06,115.57
  other vias: 33.4,113
  pour Top: 0.95,139.05 252.86,139.05 252.86,0.95 0.95,0.95
N$1
  Top 1.524: S1.1 10.16,41.91 JP11.1 8.26,43.81 8.26,43.97 6.5,45.72 1.27,45.72 1.27,85.09 3.07,86.89 U$1.RAW
N$3  (via drill 0.39)
  Top 0.762: v46.83,30.8 42.23,35.4 42.23,37.62 34.61,37.62 D9.2 | v92.87,33.18 92.55,33.5 92.55,34.29 D10.4
  Bottom 0.762: v46.83,30.8 47.94,31.91 v53.02,31.91 53.09,31.85 61.77,40.54 89.28,40.54 90.25,39.57 90.25,39.09 92.18,37.16 92.18,33.3 92.42,33.05 | 92.42,33.05 92.55,33.18 v92.87,33.18 | 92.42,33.05 v91.28,31.91
N$4  (via drill 0.39)
  Top 0.762: 97.63,37.62 D10.2 98,37.62 149.25,37.62 149.61,37.64 v152.5,40.54 | D11.4 155.42,34.45 | 155.25,34.75 D11.4 | v156.84,36.68 155.88,35.71 155.88,34.75 D11.4
  Bottom 0.762: v156.84,36.68 156.84,39.09 155.4,40.54 v152.5,40.54
N$5  (via drill 0.39)
  Top 0.762: v163.83,37.62 160.66,37.62 D11.2 | v166.85,37.47 169.86,34.45 170.12,34.25 171.5,32.88 171.81,32.82 173.25,31.37 215.72,31.37 217.65,33.3 217.65,34.27 D12.4 | 218.28,34.45 D12.4 | 217.62,34.25 218,34.25 D12.4
  Bottom 0.762: v163.83,37.62 163.99,37.47 v166.85,37.47
N$6
  Top 0.762: D12.2 223.68,37.62 227.49,41.43 227.49,110.81 205.1,133.19 37.15,133.19 37.15,122.4 27.94,113.19 28,112.88 28,108.75 29.25,107.5 29.25,106.88 D13.4 29.37,106.52
N$7  (via drill 0.39)
  Top 0.762: v38.73,110.97 35.88,110.97 34.61,109.7 D13.2 | 92.39,106.2 92.39,106.36 D14.4 92.12,106 91.38,106 91.21,105.69 91.21,104.72 90.25,103.76 75.29,103.76 74.32,104.72 74.12,104.88 72.88,106.12 v72.87,106.2
  Bottom 0.762: v38.73,110.97 43.5,106.2 v72.87,106.2
N$8
  Top 0.762: 97.63,110.62 97.63,109.7 D14.2 | 97.63,110.62 97.63,110.65 | 155.42,106.52 D15.4 155.12,106.25 154.62,106.25 154.43,106.17 154.43,104.24 153.95,103.76 107.14,103.76 106.17,104.72 106.25,104.88 100.5,110.62 97.63,110.62
N$9
  Top 0.762: 218.28,106.52 D16.4 | 161,109.5 D15.2 160.66,109.54 160.67,109.55 209.45,109.55 212.34,112.45 215.72,112.45 216.69,111.48 216.69,109.07 218.13,107.62 218.13,106.66 D16.4 | 218,106.38 D16.4
N$30
  Bottom 0.762: J2.1 26.06,32.82 42.95,32.82 46.33,29.44 48.74,29.44 50.19,30.89 52.6,30.89 53.09,30.4 80.59,30.4 88.8,38.61 J3.4
N$31
  Bottom 0.762: J3.1 89.28,32.82 90.25,31.85 90.25,31.37 98.45,23.16 137.06,23.16 152.98,39.09 J4.4
N$32
  Bottom 0.762: J4.1 153.47,32.82 156.84,32.82 157.81,31.85 208,31.85 214.76,38.61 J5.4
N$33
  Top 0.762: 19.46,32.64 R1.2 | 29.37,34.29 D9.4 29.12,34 28.96,33.78 26.54,31.37 25.09,31.37 24.13,32.33 19.79,32.33 R1.2 | 19.75,32.88 R1.2
N$34
  Bottom 0.762: J5.1 215.24,33.3 225.86,33.3 228.27,35.71 228.27,109.55 226.34,111.48 219.58,111.48 211.38,119.69 34.27,119.69 26.06,111.48 J6.4
N$35
  Bottom 0.762: J6.1 26.06,105.21 28.47,107.62 28.47,111.48 34.75,117.75 86.39,117.75 88.8,115.34 88.8,111.48 J7.4
N$36
  Bottom 0.762: J7.1 89.28,105.21 91.21,107.14 91.21,109.07 93.14,111 152.98,111 J8.4
N$37
  Bottom 0.762: J8.1 153.47,105.21 154.91,106.66 154.91,107.44 154.91,109.5 157.94,112.52 213.23,112.52 214.76,111 J9.4
NEODATA0  (via drill 0.39)
  Top 0.762: 24.13,62.07 26.04,63.98 U$1.D7 | v16.5,32.62 17.75,32.62 R1.1
  Bottom 0.762: v16.5,32.62 16.5,54.5 26,64 U$1.D7
NEODATA1
  Top 0.762: R2.1 17.88,34.12 17.88,42.75 24.12,49 24.12,59.5 26,61.38 U$1.D8
VCC  (via drill 0.39)
  Top 0.762: 14.45,130.18 14.45,136.68 TM5.A | 14.45,130.18 14.45,107.38 | 14.45,107.38 14.45,79.38 10.95,79.38 U$1.5V | 29.53,36.51 29.64,36.4 | 29.64,36.4 30.96,35.08 30.96,34.45 34.45,34.45 D9.1 | v37.78,60.96 37.78,60.48 27.94,50.64 28,50.38 27.99,50.19 27.99,36.68 | 29.69,138.27 26.51,138.27 25.72,137.48 25.72,136.84 22.23,136.84 TM6.A 21.91,136.53 21.91,130.18 14.45,130.18 | 29.69,138.27 29.69,136.84 TM7.A | 33.97,100.65 34.77,101.44 34.77,106.2 34.61,106.36 D13.1 | 26.83,100.65 27.88,100.65 | 27.88,100.65 33.97,100.65 | 37.31,135.25 37.31,136.68 TM8.A 37.15,137 37.15,138.27 29.69,138.27 | 37.31,135.25 37.31,134.78 | 37.31,135.25 43.5,135.25 44.93,136.68 TM4.A 45.24,137 45.24,138.27 51.12,138.27 51.36,138.03 | 51.36,138.03 52.55,136.84 TM3.A | 58.98,138.03 58.74,138.27 51.59,138.27 51.36,138.03 | 58.98,138.03 60.17,136.84 TM2.A | TM1.A 67.79,136.84 66.36,138.27 59.21,138.27 58.98,138.03 | v42.39,64.14 42.39,79.85 34.13,88.11 34.13,100.33 33.97,100.65 | 97.79,103.75 97.79,75.88 85.57,63.66 JP1.1 | 97.79,103.75 97.79,106.2 97.63,106.36 D14.1 | 160.81,32.88 160.81,34.13 160.66,34.29 D11.1 | 160.81,32.88 160.81,31.43 | 160.81,31.43 160.81,28.57 103.35,28.57 97.63,34.29 D10.1 97.47,34.77 96.04,36.2 | 219.87,34.45 220.25,34.45 | 220.25,34.45 223.52,34.45 D12.1 | 164.94,38.58 167.16,38.58 169.23,36.51 169.5,36.25 170.2,35.55 | 164.94,38.58 164.94,35.24 161.13,31.43 160.81,31.43 | 161.13,100.65 161.13,42.23 164.62,38.73 164.94,38.58 | 161.13,100.65 161.13,105.25 | 161.13,105.25 161.13,105.89 160.66,106.36 D15.1 | 161.13,100.65 216.88,100.65 | 216.88,100.65 222.88,100.65 223.84,101.6 223.84,106.2 223.68,106.36 D16.1
  Top 0.762: v97.79,40.01 97.79,42.55 85.57,54.77 85.57,63.34 JP1.1 | v96.36,38.58 96.04,38.26 96.04,36.2 | v66.36,67.63 83.98,67.63 83.98,65.41 85.41,63.98 JP1.1 | 217.25,35.5 217.12,35.38 | 217.25,35.5 219.5,35.5 220.25,34.75 220.25,34.45 | 96.04,36.2 95.75,36 91.75,36 91.69,35.71 90.73,36.68 89.28,36.68 J3.3 | v160.5,32.88 160.81,32.88 | 27.88,100.65 27.88,106.62 27.51,106.66 27.51,107.62 26.54,108.58 26.06,108.58 J6.3 | v97.62,103.75 97.79,103.75 | v160.88,105.25 161.13,105.25 | v216.88,101 216.88,100.65 | 170.2,35.55 170.38,35.38 | v22,107.38 14.45,107.38 | 27.99,36.68 26.06,36.68 J2.3 | 27.99,36.68 28.47,36.2 29.44,36.2 29.64,36.4 | 217.25,35.5 217.17,35.71 216.21,36.68 215.24,36.68 J5.3 214.76,36.68 171.32,36.68 170.2,35.55
  Bottom 0.762: v37.78,60.96 39.85,63.02 39.85,63.5 JP10.1 40.16,63.66 40.64,64.14 v42.39,64.14 42.7,64.29 46.04,67.63 v66.36,67.63 | v96.36,38.58 v97.79,40.01 | v160.5,32.88 158.5,32.88 156,35.38 155.88,35.71 154.91,36.68 153.47,36.68 J4.3 | v97.62,103.75 94.17,107.2 90.73,103.76 87.83,103.76 87.35,104.24 87.35,107.14 88.8,108.58 J7.3 | 157.02,106.35 158.12,105.25 v160.88,105.25 | 157.02,106.35 156,107.38 | 157.02,106.35 154.43,103.76 152.02,103.76 151.54,104.24 151.54,107.62 152.5,108.58 152.98,108.58 J8.3 | J9.3 215.24,108.58 216.69,107.14 216.69,101.35 v216.88,101 | v22,107.38 22.2,107.62 24.61,107.62 25.58,108.58 J6.3

### Text on the board
tNames: + | + | + | + | + | + | + | + | + | + | + | + | + | + | +